# EAGLE design Tiny85 and 4-Pin Header (EAGLE 7.2.0)
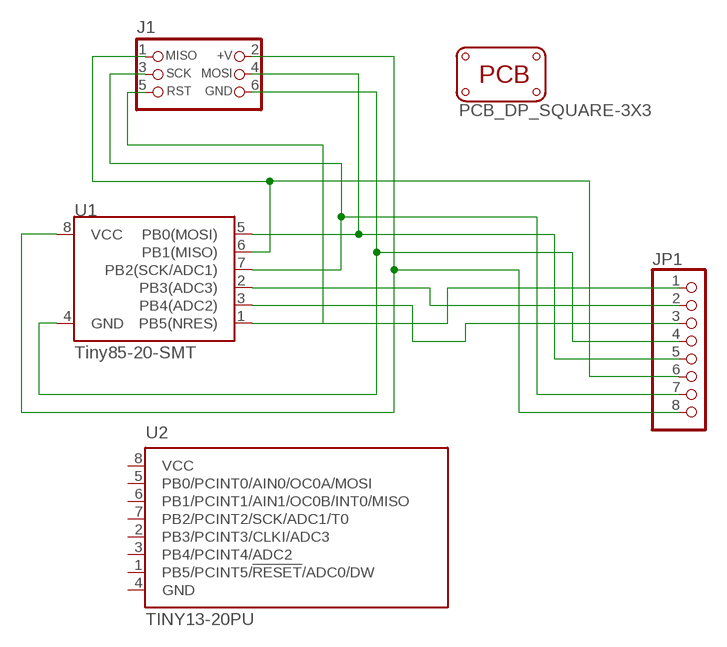
[diagram p0: schematic, sheet 1]

## Parts
J1  CON_HEADER_PRG_AVR_ICSP-PTH  [HEADER_PRG_2X03]
JP1  PINHD-1X8CLEANBIG  [1X08-CLEANBIG]
PCB1  PCB_DP_SQUARE-3X3  [DP3030_V1]
U1  Tiny85-20-SMT  ATTINY45TINY85-20-SMT  [SO08-EIAJ]
U2  TINY13-20PU  [8P3]

## Nets
N$1: J1.6(GND) JP1.4 U1.4(GND)
N$2: J1.2(+V) JP1.8 U1.8(VCC)
N$3: J1.3(SCK) JP1.7 U1.7(PB2(SCK/ADC1))
N$4: J1.4(MOSI) JP1.5 U1.5(PB0(MOSI))
N$5: JP1.2 U1.2(PB3(ADC3))
N$6: J1.5(RST) JP1.1 U1.1(PB5(NRES))
N$7: J1.1(MISO) JP1.6 U1.6(PB1(MISO))
N$8: JP1.3 U1.3(PB4(ADC2))
Unconnected: U2.1(PB5/PCINT5/!RESET!/ADC0/DW) U2.2(PB3/PCINT3/CLKI/ADC3) U2.3(PB4/PCINT4/ADC2) U2.5(PB0/PCINT0/AIN0/OC0A/MOSI) U2.6(PB1/PCINT1/AIN1/OC0B/INT0/MISO) U2.7(PB2/PCINT2/SCK/ADC1/T0)

## Power pins joined to a net without a drawn wire
GND: U2.4(GND)
VCC: U2.8(VCC)

## Library data of the parts
J1 = dp_devices:CON_HEADER_PRG_AVR_ICSP: 2x3 AVR ICSP programming header
JP1 = adafruit:PINHD-1X8: PIN HEADER
PCB1 = dp_pcb:PCB_DP_SQUARE: Dangerous Prototypes Standard Square PCB sizes
U1 = SparkFun-DigitalIC:ATTINY45: Atmel 8-pin 2/4/8kB flash uC; PROD_ID: IC-09092
U2 = ATtiny[248]5:TINY13: 8-bit AVR Microcontroller with 1K Bytes In-System Programmable Flash Source: http://www.atmel.com/dyn/resources/prod_documents/2535S.pdf; MPN: ATTINY13-20PU; OC_FARNELL: 9171550; OC_NEWARK: 96K6521

## Board
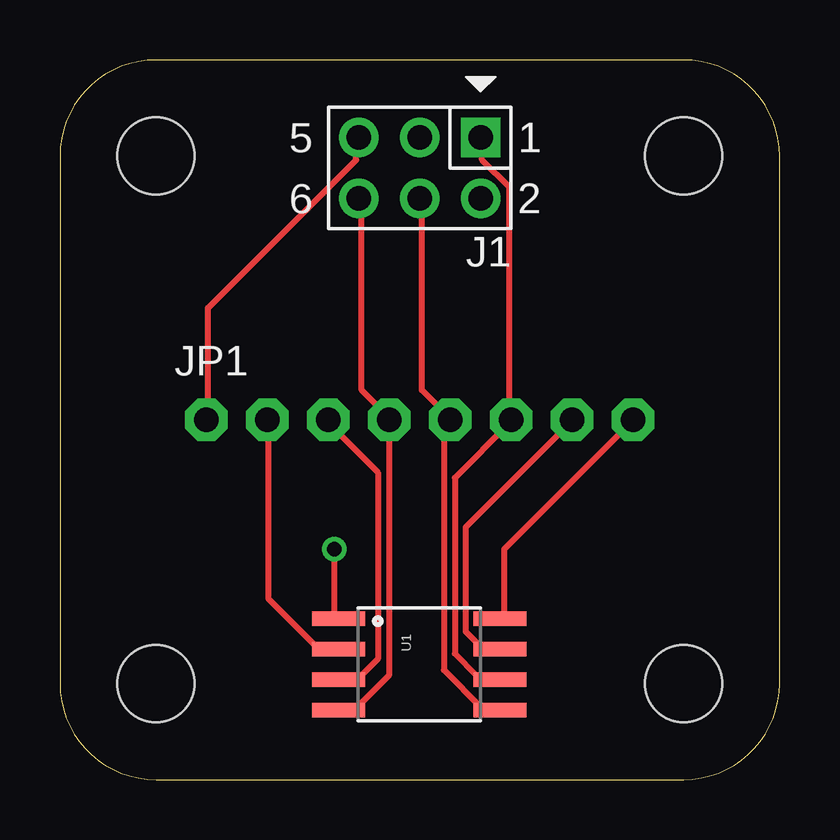
[diagram p1: board, top side]
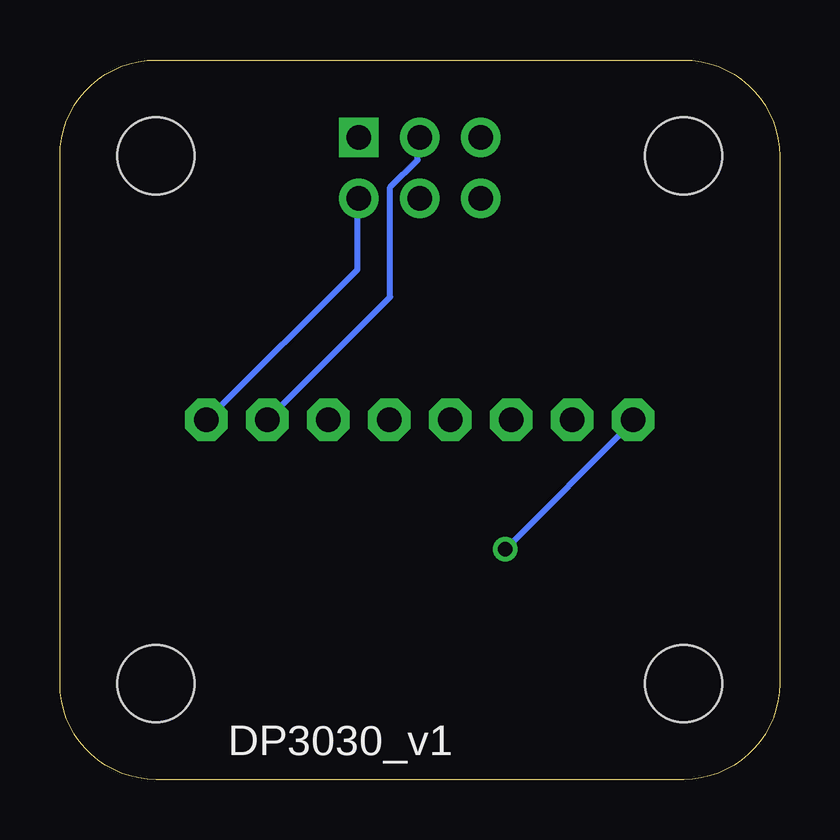
[diagram p2: board, bottom side, seen from below]

Size 30 x 30 mm. Coordinates in mm from the lower left corner, seen from the top.
Copper layers (1*16): Top 0.035mm / dielectric 1.5mm / Bottom 0.035mm
Design rules "default": minimum track width 10mil, minimum drill 24mil, track to track 8mil, track to pad 8mil, pad to pad 8mil, via to via 8mil, smd to smd 8mil, copper to edge 40mil, drill to drill 8mil, minimum pad ring 10mil, minimum via ring 8mil, stop-mask expansion 4mil, vias tented up to drill 0mil, thermal gap 10mil

### Footprints (pad centres in the part's own frame; a part is rotated, then mirrored left to right if it is on the bottom)
HEADER_PRG_2X03 = drill 1.02 pad 1.632 square: 1 -2.54,-1.27 | drill 1.02 pad 1.632: 2 -2.54,1.27; 3 0,-1.27; 4 0,1.27; 5 2.54,-1.27; 6 2.54,1.27
1X08-CLEANBIG = drill 1.016 pad 1.778 octagon: 1 -8.89,0; 2 -6.35,0; 3 -3.81,0; 4 -1.27,0; 5 1.27,0; 6 3.81,0; 7 6.35,0; 8 8.89,0
DP3030_V1 = hole 3.2: 4,4; 26,4; 26,26; 4,26
SO08-EIAJ = smd 0.61 x 2.21: 1 -1.905,-3.378; 2 -0.635,-3.378; 3 0.635,-3.378; 4 1.905,-3.378; 5 1.905,3.353; 6 0.635,3.353; 7 -0.635,3.353; 8 -1.905,3.353
8P3 = drill 0.813 long: 1 -3.81,-3.81; 2 -1.27,-3.81; 3 1.27,-3.81; 4 3.81,-3.81; 5 3.81,3.81; 6 1.27,3.81; 7 -1.27,3.81; 8 -3.81,3.81

### Placement (x,y rotation side)
J1  15,25.5 180 top
JP1  15,15 0 top
PCB1  0,0 0 top
U1  15,4.8 270 top
U2  -6.35,-15.24 0 top  (outside the outline)

### Tracks (layer width: path | path; a pad name or v marks a point on that pad's centre or on a via)
N$1
  Top 0.254: U1.4 11.66,2.97 12.34,2.97 13.72,4.34 13.72,14.86 JP1.4 13.72,15.09 12.57,16.23 12.57,24 J1.6
N$2
  Top 0.254: U1.8 18.52,6.86 18.52,9.6 23.77,14.86 JP1.8
  Bottom 0.254: J1.2 17.6,24 17.6,21.26 23.77,15.09 JP1.8
N$3
  Top 0.254: U1.7 18.29,5.49 17.6,5.49 16.92,6.17 16.92,10.52 21.26,14.86 JP1.7
  Bottom 0.254: J1.3 15.09,26.75 15.09,25.83 16.23,24.69 16.23,20.12 21.26,15.09 JP1.7
N$4
  Top 0.254: U1.5 18.29,2.97 17.6,2.97 16,4.57 16,14.63 16.23,14.86 JP1.5 16.23,15.09 15.09,16.23 15.09,24 J1.4
N$5
  Top 0.254: U1.2 11.43,5.49 10.74,5.49 8.69,7.54 8.69,14.86 JP1.2
N$6  (via drill 0.61)
  Top 0.254: v11.43,9.6 11.43,6.86 U1.1 | J1.5 12.34,26.75 12.34,25.83 6.17,19.66 6.17,15.09 JP1.1
  Bottom 0.254: v11.43,9.6 6.17,14.86 JP1.1
N$7
  Top 0.254: U1.6 18.29,4.34 17.37,4.34 16.46,5.26 16.46,12.57 18.75,14.86 JP1.6 18.75,15.09 18.75,24.69 17.6,25.83 17.6,26.75 J1.1
N$8
  Top 0.254: U1.3 11.66,4.34 12.57,4.34 13.26,5.03 13.26,12.8 11.2,14.86 JP1.3